# EAGLE schematic schematv2 (EAGLE 8.1.1)
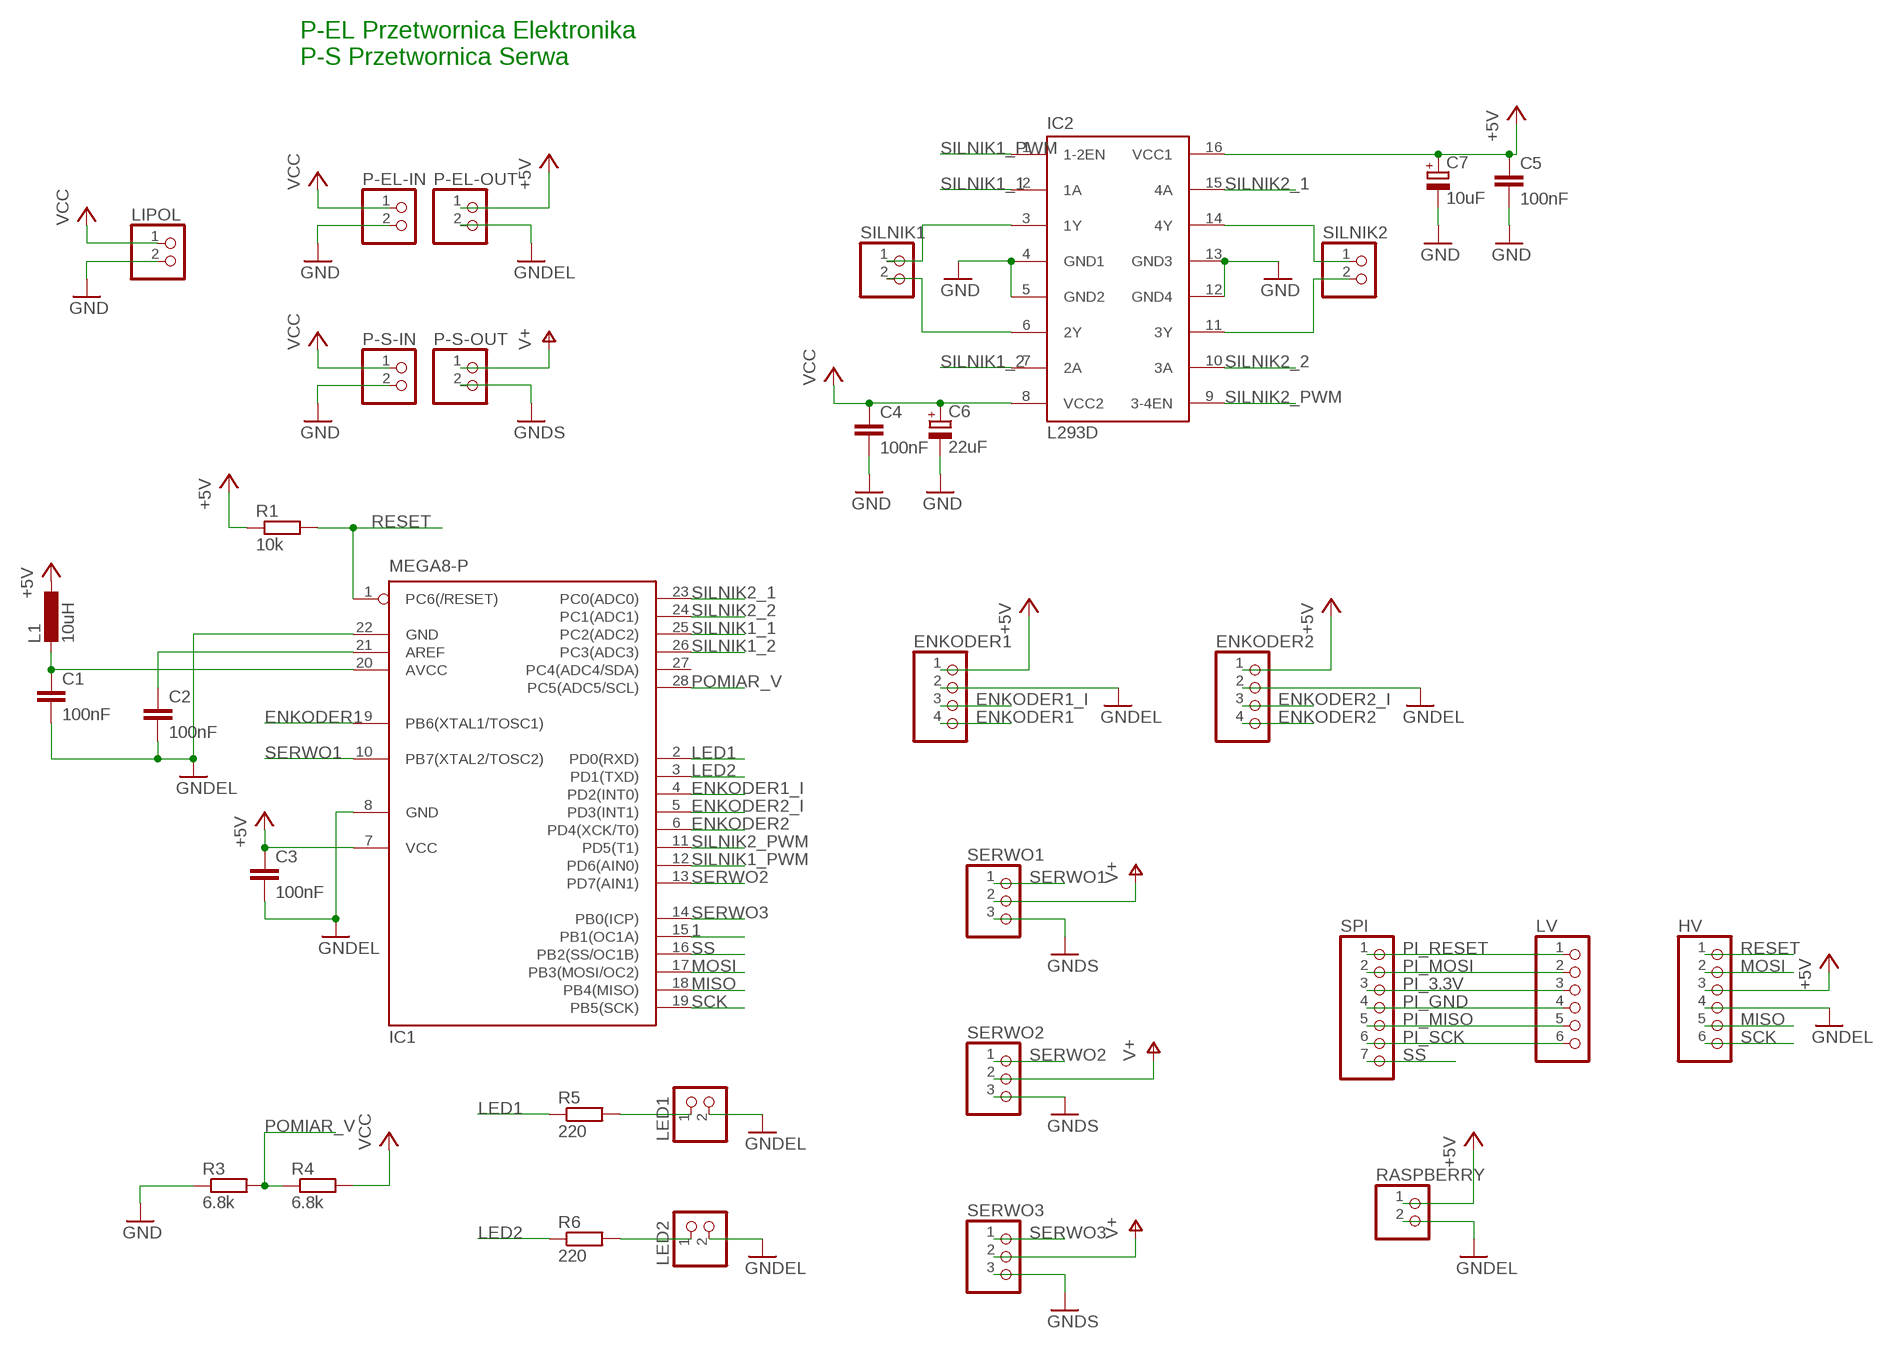
[diagram p0: schematic, sheet 1]

## Parts
C1  100nF  C-EU050-030X075  [C050-030X075]
C2  100nF  C-EU025-030X050  [C025-030X050]
C3  100nF  C-EU025-030X050  [C025-030X050]
C4  100nF  C-EU025-030X050  [C025-030X050]
C5  100nF  C-EU025-030X050  [C025-030X050]
C6  22uF  CPOL-EUE2.5-5  [E2,5-5]
C7  10uF  CPOL-EUE2.5-5  [E2,5-5]
ENKODER1  PINHD-1X4  [1X04]
ENKODER2  PINHD-1X4  [1X04]
HV  PINHD-1X6  [1X06]
IC1  MEGA8-P  [DIL28-3]
IC2  L293D  [DIL16]
L1  10uH  L-EU0204/7  [0204/7]
LED1  PINHD-1X2  [1X02]
LED2  PINHD-1X2  [1X02]
LIPOL  PINHD-1X2  [1X02]
LV  PINHD-1X6  [1X06]
P-EL-IN  PINHD-1X2  [1X02]
P-EL-OUT  PINHD-1X2  [1X02]
P-S-IN  PINHD-1X2  [1X02]
P-S-OUT  PINHD-1X2  [1X02]
R1  10k  R-EU_0204/7  [0204/7]
R3  6.8k  R-EU_0204/7  [0204/7]
R4  6.8k  R-EU_0204/7  [0204/7]
R5  220  R-EU_0204/7  [0204/7]
R6  220  R-EU_0204/7  [0204/7]
RASPBERRY  PINHD-1X2  [1X02]
SERWO1  PINHD-1X3  [1X03]
SERWO2  PINHD-1X3  [1X03]
SERWO3  PINHD-1X3  [1X03]
SILNIK1  PINHD-1X2  [1X02]
SILNIK2  PINHD-1X2  [1X02]
SPI  PINHD-1X7  [1X07]

## Nets
1: IC1.15(PB1(OC1A))
+5V: C3.1 C5.1 C7.+ ENKODER1.1 ENKODER2.1 HV.3 IC1.7(VCC) IC2.16(VCC1) L1.1 P-EL-OUT.1 R1.1 RASPBERRY.1
ENKODER1: ENKODER1.4 IC1.9(PB6(XTAL1/TOSC1))
ENKODER1_I: ENKODER1.3 IC1.4(PD2(INT0))
ENKODER2: ENKODER2.4 IC1.6(PD4(XCK/T0))
ENKODER2_I: ENKODER2.3 IC1.5(PD3(INT1))
GND: C4.2 C5.2 C6.- C7.- IC2.4(GND1) IC2.5(GND2) IC2.12(GND4) IC2.13(GND3) LIPOL.2 P-EL-IN.2 P-S-IN.2 R3.1
GNDEL: C1.2 C2.2 C3.2 ENKODER1.2 ENKODER2.2 HV.4 IC1.8(GND) IC1.22(GND) LED1.2 LED2.2 P-EL-OUT.2 RASPBERRY.2
GNDS: P-S-OUT.2 SERWO1.3 SERWO2.3 SERWO3.3
LED1: IC1.2(PD0(RXD)) R5.1
LED2: IC1.3(PD1(TXD)) R6.1
MISO: HV.5 IC1.18(PB4(MISO))
MOSI: HV.2 IC1.17(PB3(MOSI/OC2))
N$1: IC2.14(4Y) SILNIK2.1
N$2: C2.1 IC1.21(AREF)
N$3: C1.1 IC1.20(AVCC) L1.2
N$4: IC2.11(3Y) SILNIK2.2
N$7: IC2.3(1Y) SILNIK1.1
N$8: LED1.1 R5.2
N$9: LED2.1 R6.2
N$10: IC2.6(2Y) SILNIK1.2
PI_3.3V: LV.3 SPI.3
PI_GND: LV.4 SPI.4
PI_MISO: LV.5 SPI.5
PI_MOSI: LV.2 SPI.2
PI_RESET: LV.1 SPI.1
PI_SCK: LV.6 SPI.6
POMIAR_V: IC1.28(PC5(ADC5/SCL)) R3.2 R4.1
RESET: HV.1 IC1.1(PC6(/RESET)) R1.2
SCK: HV.6 IC1.19(PB5(SCK))
SERWO1: IC1.10(PB7(XTAL2/TOSC2)) SERWO1.1
SERWO2: IC1.13(PD7(AIN1)) SERWO2.1
SERWO3: IC1.14(PB0(ICP)) SERWO3.1
SILNIK1_1: IC1.25(PC2(ADC2)) IC2.2(1A)
SILNIK1_2: IC1.26(PC3(ADC3)) IC2.7(2A)
SILNIK1_PWM: IC1.12(PD6(AIN0)) IC2.1(1-2EN)
SILNIK2_1: IC1.23(PC0(ADC0)) IC2.15(4A)
SILNIK2_2: IC1.24(PC1(ADC1)) IC2.10(3A)
SILNIK2_PWM: IC1.11(PD5(T1)) IC2.9(3-4EN)
SS: IC1.16(PB2(SS/OC1B)) SPI.7
V+: P-S-OUT.1 SERWO1.2 SERWO2.2 SERWO3.2
VCC: C4.1 C6.+ IC2.8(VCC2) LIPOL.1 P-EL-IN.1 P-S-IN.1 R4.2
Unconnected: IC1.27(PC4(ADC4/SDA))

## Notes on the sheet
- P-EL Przetwornica Elektronika
  P-S Przetwornica Serwa

## Library data of the parts
C1-C5 = rcl:C-EU: CAPACITOR, European symbol
C6 C7 = rcl:CPOL-EU: POLARIZED CAPACITOR, European symbol
ENKODER1 ENKODER2 = pinhead:PINHD-1X4: PIN HEADER
HV LV = pinhead:PINHD-1X6: PIN HEADER
IC1 = atmel:MEGA8-P: MICROCONTROLLER 8 Kbytes FLASH, 1 kbytes SRAM, 512 bytes EEPROM, USART, 4-channel 10 bit ADC, 2-channel 8 bit ADC Pin compatible with Atmega48, ATMega88, ATMega168 Source: avr.lbr; OC_FARNELL: unknown; OC_NEWARK: unknown
IC2 = st-microelectronics:L293D: PUSH-PULL 4 CHANNEL DRIVER; MPN: L293D; OC_FARNELL: 9589619; OC_NEWARK: 56P8249
L1 = rcl:L-EU: INDUCTOR, European symbol
LED1 LED2 LIPOL P-EL-IN P-EL-OUT P-S-IN P-S-OUT RASPBERRY SILNIK1 SILNIK2 = pinhead:PINHD-1X2: PIN HEADER
R1 R3-R6 = rcl:R-EU_: RESISTOR, European symbol
SERWO1-SERWO3 = pinhead:PINHD-1X3: PIN HEADER
SPI = pinhead:PINHD-1X7: PIN HEADER